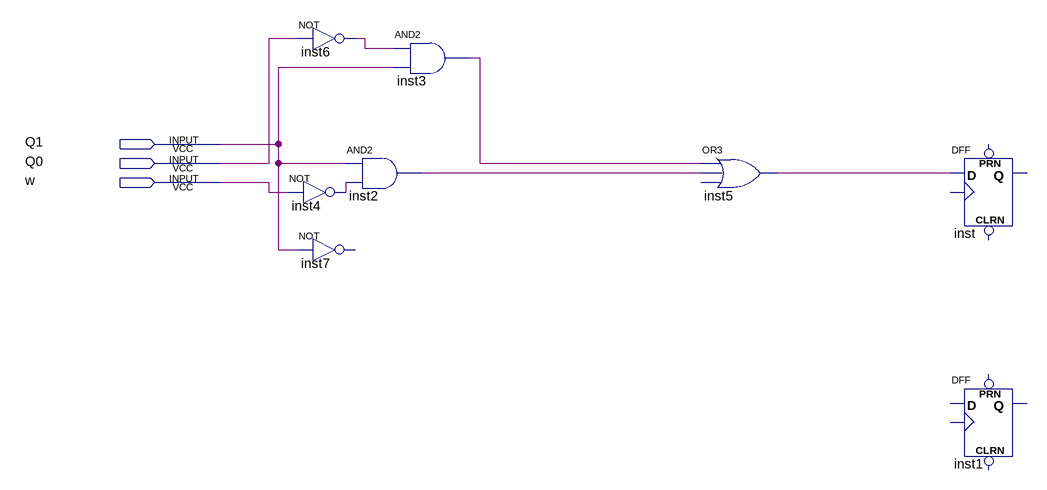
[diagram p0: schematic sheet]
// Quartus schematic lab11step2.bdf as structural Verilog: 8 symbols, 3 pins
module lab11step2 (
  input  Q1,
  input  Q0,
  input  w
);

  wire inst2_out, inst3_out, inst4_out, inst5_out, inst6_out;

  not inst6 (inst6_out, Q0);
  not inst4 (inst4_out, w);
  // NOT inst7 has open pins: IN=Q1, OUT=open
  and inst3 (inst3_out, inst6_out, Q1);
  and inst2 (inst2_out, Q1, inst4_out);
  or inst5 (inst5_out, inst3_out, inst2_out);  // open: IN3
  DFF inst (.D(inst5_out));  // open: CLRN, CLK, PRN, Q
  DFF inst1 ();  // open: CLRN, CLK, D, PRN, Q
endmodule
